# Altium schematic sheet Microcontrolador.V03.R00.SchDoc: Microcontrolador RP2040
size A3; SheetNumber: 2; SheetTotal: 18
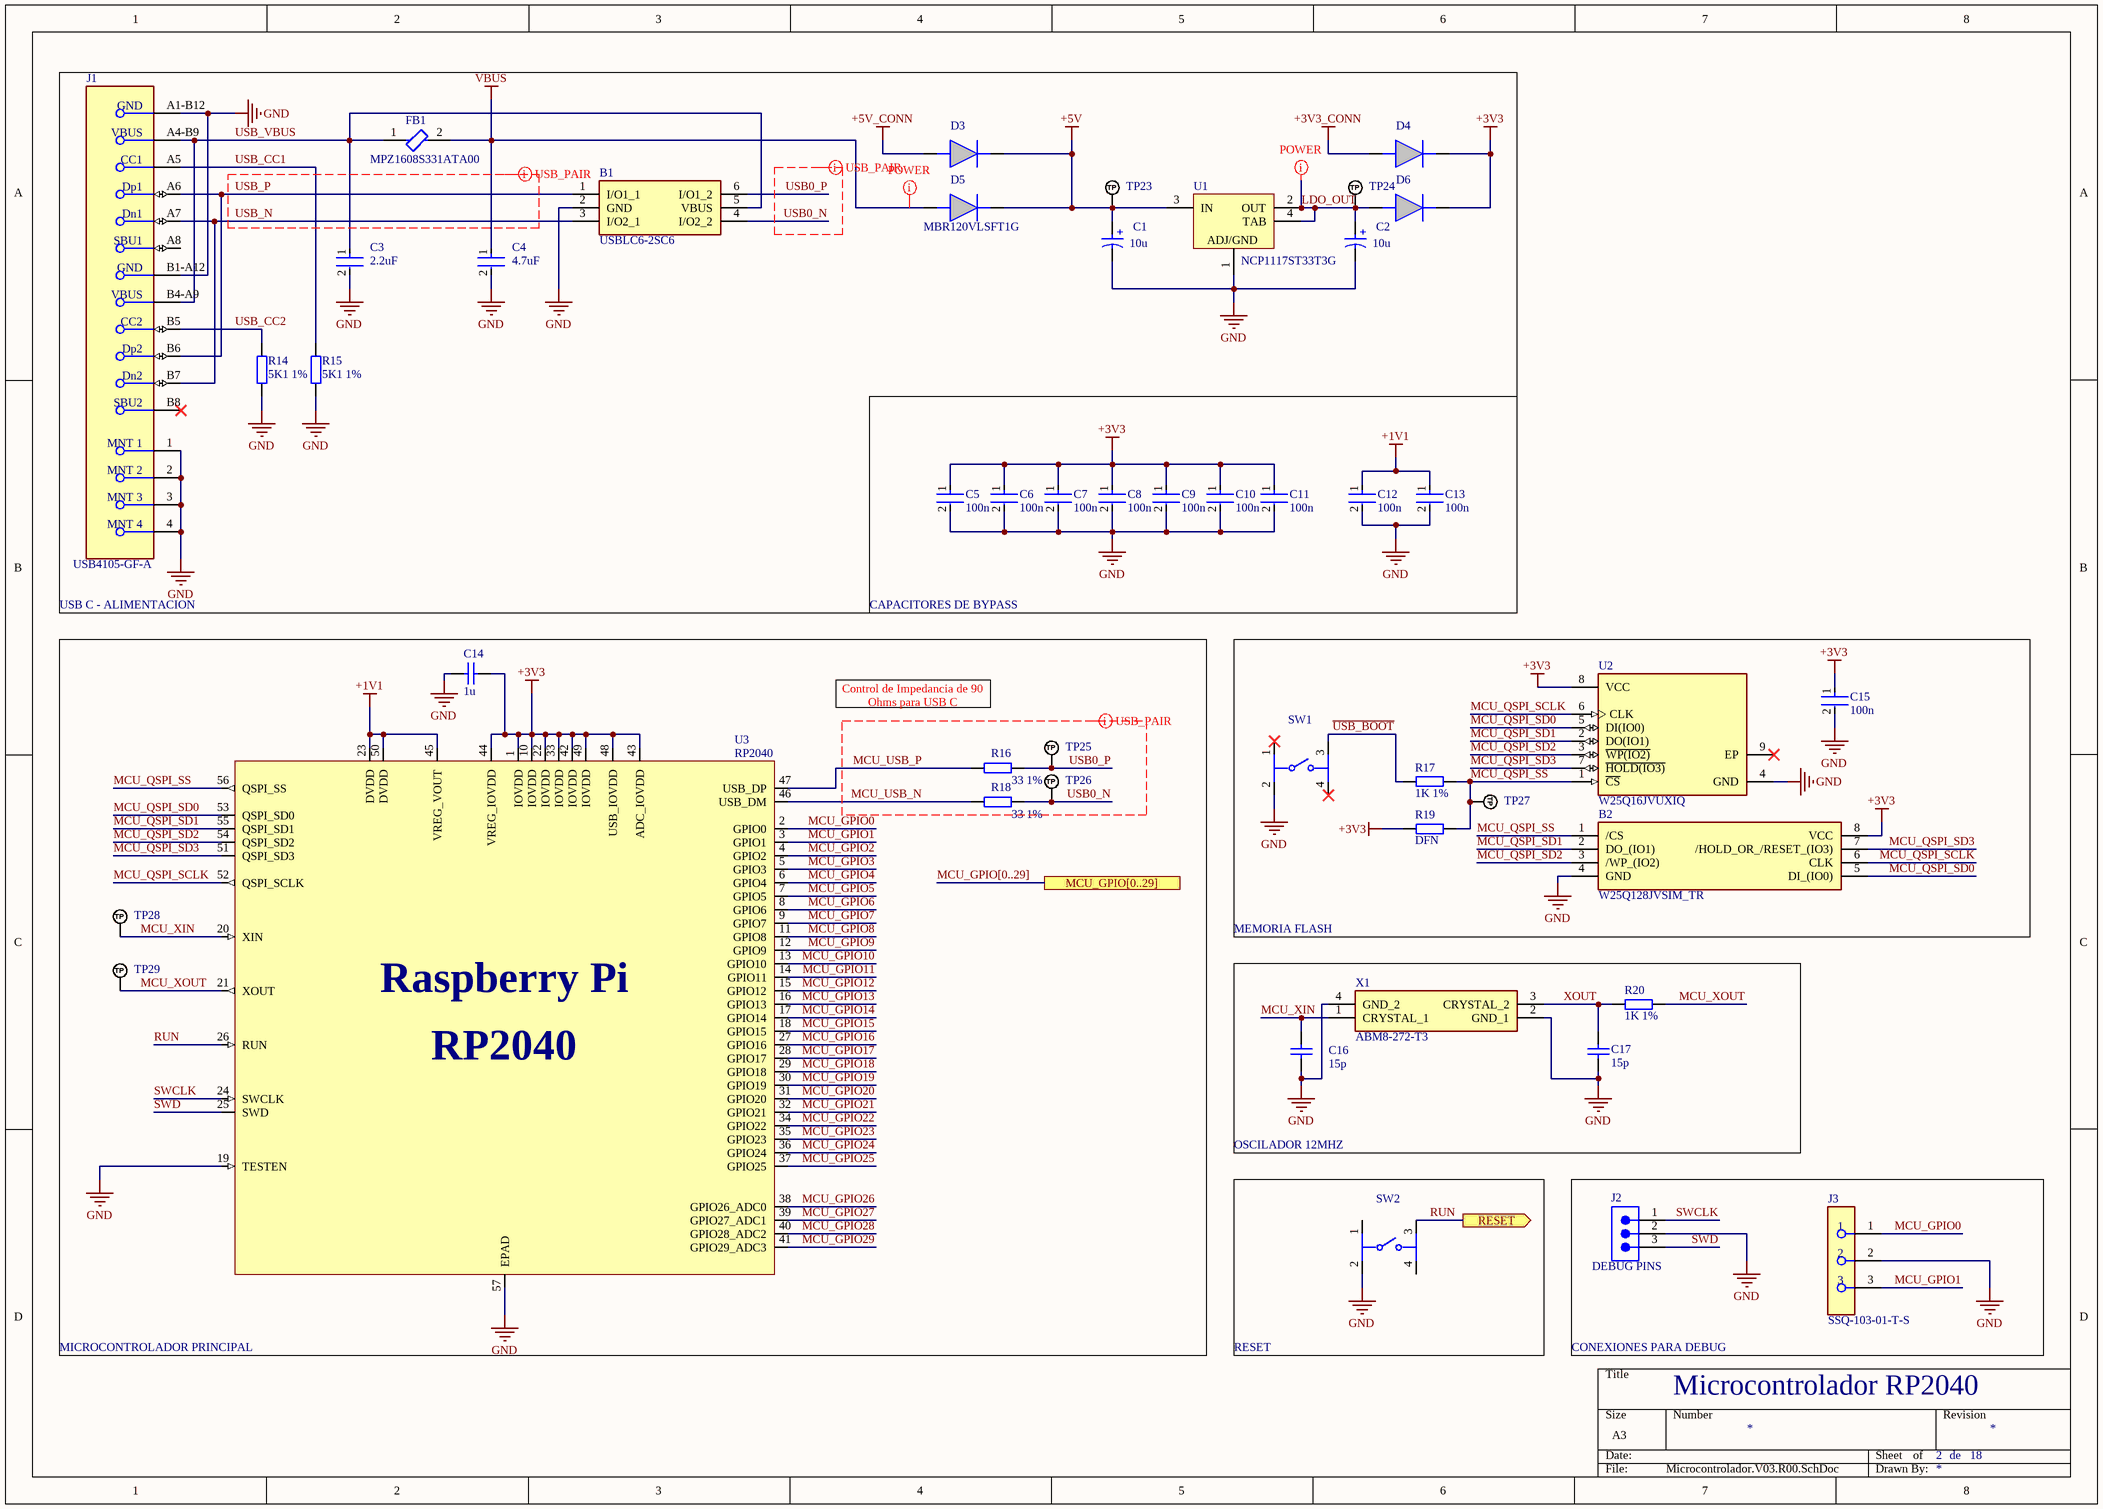
[diagram p0: Microcontrolador.V03.R00.SchDoc]

## Parts
B1  USBLC6-2SC6  [SOT95P280X145-6N]
B2  W25Q128JVSIM_TR  [SOIC127P790X216-8N]
C1  10u  [WCAP-ASLI_D6.3H7.7]
C2  10u  [WCAP-ASLI_D6.3H7.7]
C3  2.2uF  [FP-CC0603-DA-MFG]
C4  4.7uF  [FP-GRM21B-0_15-IPC_A]
C5  100n  [FP-CC0805-EB-MFG]
C6  100n  [FP-CC0805-EB-MFG]
C7  100n  [FP-CC0805-EB-MFG]
C8  100n  [FP-CC0805-EB-MFG]
C9  100n  [FP-CC0805-EB-MFG]
C10  100n  [FP-CC0805-EB-MFG]
C11  100n  [FP-CC0805-EB-MFG]
C12  100n  [FP-CC0805-EB-MFG]
C13  100n  [FP-CC0805-EB-MFG]
C14  1u  [CAPC2013X140X50NL20T25]
C15  100n  [FP-CC0805-EB-MFG]
C16  15p  [CAPC2013X94X50NL20T25]
C17  15p  [CAPC2013X94X50NL20T25]
D3  MBR120VLSFT1G  [SODFL3616X98N]  (value not drawn)
D4  MBR120VLSFT1G  [SODFL3616X98N]  (value not drawn)
D5  MBR120VLSFT1G  [SODFL3616X98N]
D6  MBR120VLSFT1G  [SODFL3616X98N]  (value not drawn)
FB1  MPZ1608S331ATA00  [FP-MPZ1608-0_8-IPC_C]
J1  USB4105-GF-A  [FP-USB4105-GF-A-MFG]
J2  DEBUG PINS  [SMTC-MTSW-103-08-X-S-229-RA]
J3  SSQ-103-01-T-S  [FP-SSQ-103-01-T-S-MFG]
R14  5K1 1%  [RES_0805]
R15  5K1 1%  [RES_0805]
R16  33 1%  [RES_0805]
R17  1K 1%  [RES_0805]
R18  33 1%  [RES_0805]
R19  DFN  [RES_0805]
R20  1K 1%  [RES_0805]
SW1  BOOT  [FP-2-1977223-2-MFG]  (value not drawn)
SW2  RESET  [FP-2-1977223-2-MFG]  (value not drawn)
TP23  TP_NOBOM  [PAD_RND_1MM]  (value not drawn)  (no BOM)
TP24  TP_NOBOM  [PAD_RND_1MM]  (value not drawn)  (no BOM)
TP25  TP_NOBOM  [PAD_RND_1MM]  (value not drawn)  (no BOM)
TP26  TP_NOBOM  [PAD_RND_1MM]  (value not drawn)  (no BOM)
TP27  TP_NOBOM  [PAD_RND_1MM]  (value not drawn)  (no BOM)
TP28  TP_NOBOM  [PAD_RND_1MM]  (value not drawn)  (no BOM)
TP29  TP_NOBOM  [PAD_RND_1MM]  (value not drawn)  (no BOM)
U1  NCP1117ST33T3G  [ONSC-SOT-223-4-318H-01_A_V]
U2  W25Q16JVUXIQ  [FP-UX-MFG]
U3  RP2040  [QFN-56-EP]
X1  ABM8-272-T3  [ABM8272T3]

## Blocks framed on the sheet
USB C - ALIMENTACION: B1 C1-C4 D3-D6 FB1 J1 R14 R15 TP23 TP24 U1
CAPACITORES DE BYPASS: C5-C13
MICROCONTROLADOR PRINCIPAL: C14 R16 R18 TP25 TP26 TP28 TP29 U3
MEMORIA FLASH: B2 C15 R17 R19 SW1 TP27 U2
OSCILADOR 12MHZ: C16 C17 R20 X1
RESET: SW2
CONEXIONES PARA DEBUG: J2 J3

## Ports
MCU_GPIO[0..29], RESET (out)

## Nets
+1V1: C12.1 C13.1 U3.23(DVDD) U3.45(VREG_VOUT) U3.50(DVDD)
+3V3: B2.8(VCC) C5.1 C6.1 C7.1 C8.1 C9.1 C10.1 C11.1 C14.2 C15.1 D4.1(K) D6.1(K) R19.1 U2.8(VCC) U3.1(IOVDD) U3.10(IOVDD) U3.22(IOVDD) U3.33(IOVDD) U3.42(IOVDD) U3.43(ADC_IOVDD) U3.44(VREG_IOVDD) U3.48(USB_IOVDD) U3.49(IOVDD)
+3V3_CONN: D4.2(A)
+5V: C1.1(P) D3.1(K) D5.1(K) TP23.1(TP) U1.3(IN)
+5V_CONN: D3.2(A)
GND: B1.2(GND) B2.4(GND) C1.2(N) C2.2(N) C3.2 C4.2 C5.2 C6.2 C7.2 C8.2 C9.2 C10.2 C11.2 C12.2 C13.2 C14.1 C15.2 C16.1 C17.1 J1.1(MNT_1) J1.2(MNT_2) J1.3(MNT_3) J1.4(MNT_4) J1.A1-B12(GND) J1.B1-A12(GND) J2.2 J3.2 R14.1 R15.1 SW1.2 SW2.2 U1.1(ADJ/GND) U2.4(GND) U3.19(TESTEN) U3.57(EPAD) X1.2(GND_1) X1.4(GND_2)
VBUS: C4.1 D5.2(A) FB1.2
~{USB_BOOT}: R17.1 SW1.3
LDO_OUT: C2.1(P) D6.2(A) TP24.1(TP) U1.2(OUT) U1.4(TAB)
MCU_GPIO0: J3.1 U3.2(GPIO0)
MCU_GPIO1: J3.3 U3.3(GPIO1)
MCU_GPIO2: U3.4(GPIO2)
MCU_GPIO3: U3.5(GPIO3)
MCU_GPIO4: U3.6(GPIO4)
MCU_GPIO5: U3.7(GPIO5)
MCU_GPIO6: U3.8(GPIO6)
MCU_GPIO7: U3.9(GPIO7)
MCU_GPIO8: U3.11(GPIO8)
MCU_GPIO9: U3.12(GPIO9)
MCU_GPIO10: U3.13(GPIO10)
MCU_GPIO11: U3.14(GPIO11)
MCU_GPIO12: U3.15(GPIO12)
MCU_GPIO13: U3.16(GPIO13)
MCU_GPIO14: U3.17(GPIO14)
MCU_GPIO15: U3.18(GPIO15)
MCU_GPIO16: U3.27(GPIO16)
MCU_GPIO17: U3.28(GPIO17)
MCU_GPIO18: U3.29(GPIO18)
MCU_GPIO19: U3.30(GPIO19)
MCU_GPIO20: U3.31(GPIO20)
MCU_GPIO21: U3.32(GPIO21)
MCU_GPIO22: U3.34(GPIO22)
MCU_GPIO23: U3.35(GPIO23)
MCU_GPIO24: U3.36(GPIO24)
MCU_GPIO25: U3.37(GPIO25)
MCU_GPIO26: U3.38(GPIO26_ADC0)
MCU_GPIO27: U3.39(GPIO27_ADC1)
MCU_GPIO28: U3.40(GPIO28_ADC2)
MCU_GPIO29: U3.41(GPIO29_ADC3)
MCU_QSPI_SCLK: B2.6(CLK) U2.6(CLK) U3.52(QSPI_SCLK)
MCU_QSPI_SD0: B2.5(DI_(IO0)) U2.5(DI(IO0)) U3.53(QSPI_SD0)
MCU_QSPI_SD1: B2.2(DO_(IO1)) U2.2(DO(IO1)) U3.55(QSPI_SD1)
MCU_QSPI_SD2: B2.3(/WP_(IO2)) U2.3(~{WP(IO2)}) U3.54(QSPI_SD2)
MCU_QSPI_SD3: B2.7(/HOLD_OR_/RESET_(IO3)) U2.7(~{HOLD(IO3)}) U3.51(QSPI_SD3)
MCU_QSPI_SS: B2.1(/CS) R17.2 R19.2 TP27.1(TP) U2.1(~{CS}) U3.56(QSPI_SS)
MCU_USB_N: R18.1 U3.46(USB_DM)
MCU_USB_P: R16.1 U3.47(USB_DP)
MCU_XIN: C16.2 TP28.1(TP) U3.20(XIN) X1.1(CRYSTAL_1)
MCU_XOUT: R20.2 TP29.1(TP) U3.21(XOUT)
RUN: SW2.3 U3.26(RUN) ; port RESET
SWCLK: J2.1 U3.24(SWCLK)
SWD: J2.3 U3.25(SWD)
USB0_N: B1.4(I/O2_2) R18.2 TP26.1(TP)
USB0_P: B1.6(I/O1_2) R16.2 TP25.1(TP)
USB_CC1: J1.A5(CC1) R15.2
USB_CC2: J1.B5(CC2) R14.2
USB_N: B1.3(I/O2_1) J1.A7(Dn1) J1.B7(Dn2)
USB_P: B1.1(I/O1_1) J1.A6(Dp1) J1.B6(Dp2)
USB_VBUS: B1.5(VBUS) C3.1 FB1.1 J1.A4-B9(VBUS) J1.B4-A9(VBUS)
XOUT: C17.2 R20.1 X1.3(CRYSTAL_2)

Not connected (* = marked no-connect by the designer): J1 A8(SBU1) B8(SBU2)*; SW1 1* 4*; SW2 1 4; U2 9(EP)*

## Buses and harness runs
bus MCU_GPIO[0..29] = port MCU_GPIO[0..29]

## Layout directives
differential pair; differential pair class USB; rule Differential Pairs Routing [Pref Gap = 0.127mm    Min Gap  = 0.127mm    Max Gap  = 0.2mmPref Width = 0.15mm    Min Width  = 0.116mm    Max Width  = 0.16mm]; rule Matched Net Lengths [Tolerance = 0.25mm]; net class USB: MCU_USB_N, MCU_USB_P, USB0_N, USB0_P, USB_N, USB_P
net class POWER; rule Width Constraint [Pref Width = 0.5mm    Min Width = 0.2mm    Max Width = 1mm]; rule Routing Via Style [Pref Size = 1.27mm    Pref Hole Size = 0.711mm]; rule Clearance Constraint [Clearance = 0.2mm]; rule Polygon Connect Style [Style - Direct Connect]: LDO_OUT, VBUS

## Notes on the sheet
- Control de Impedancia de 90 Ohms para USB C
- de
- (in symbol CMP-03913-89507488-2) +

## Library data of the parts
B1 = USBLC6-2SC6: TVS Diode Array Uni-Directional USBLC6-2SC6 17V, SOT-23 6-Pin; Manufacturer_Name: STMicroelectronics; Geometry.Height: 1.45mm; Mouser Part Number: 511-USBLC6-2SC6; Mouser Price/Stock: https://www.mouser.co.uk/ProductDetail/STMicroelectronics/USBLC6-2SC6?qs=po45yt2pPpu%2FhNIlwQdTlg%3D%3D; Manufacturer_Part_Number: USBLC6-2SC6; Datasheet Link: https://www.st.com/resource/en/datasheet/usblc6-2.pdf
B2 = W25Q128JVSIM_TR: 3V 128M-BIT SERIAL FLASH MEMORY WITH DUAL/QUAD SPI & QPI & DTR; Manufacturer_Name: Winbond; Manufacturer_Part_Number: W25Q128JVSIM TR; Geometry.Height: 2.16mm; Mouser Part Number: 454-W25Q128JVSIMTR; Mouser Price/Stock: https://www.mouser.co.uk/ProductDetail/Winbond/W25Q128JVSIM-TR?qs=qSfuJ%252Bfl%2Fd6ji9IuruL6Zg%3D%3D; Datasheet Link: http://www.winbond.com/resource-files/w25q128jv%20dtr%20revb%2011042016.pdf
C1 C2 = CMP-03913-89507488-2: WCAP-ASLI Radial Can - SMD aluminum electrolytic capacitor 0.248Dia 6.30mm ±20% 10muF 80V; Capacitance: 10µF; Leakage Current: 8µA; Insulation Resistance: 10MΩ; Ripple Current: 35mA; Impedance: 2.661Ω; Max Operating Temperature: 105°C; RoHS: Compliant; Voltage Rating: 80V; Width: 6.6mm; Min Operating Temperature: -55°C; Voltage Rating (DC): 80V; Packaging: Cut Tape; Diameter: 6.3mm; Height: 7.7mm; Length: 7.7mm
C3 = CMP-03422-000187-1: CC0603 2.2 uF X5R 10.00% 16 V; Manufacturer: YAGEO; Manufacturer Part Number: CC0603KPX5R7BB225; Voltage Rating: 16 V; Material: Ceramic; Tolerance: 0.1; Temperature Coefficient: 15%; ComponentLink2Description: Datasheet; Device Class L3: Ceramic Capacitors; Temperature Characteristic: X5R; Package: CC0603-DA; Automotive: No; Device Class L1: Passive Components; ComponentLink2URL: http://www.yageo.com/documents/recent/UPY-GPHC_X7R_6.3V-to-50V_18.pdf; Value: 2.2 uF; RoHS: TRUE; Height: 0.9mm; Temperature Range High: +125°C; Footprint Url: http://www.yageo.com/exep/pages/download/literatures/UPY-C_GEN_24.pdf; Lead Free: Yes; Temperature Range Low: -55°C; Capacitance: 2.2 uF; Octopart: https://octopart.com/cc0603kpx5r7bb225-yageo-91091799; Device Class L2: Capacitors; Voltage: 16 V; Temperature: -55°C to +125°C; Category: Cap
C4 = CMP-06035-033280-1: Chip Multilayer Ceramic Capacitors for General Purpose, 0805, 4.7uF, X6S, 22%, 20%, 35V; Length: 2mm; Dielectric: X6S; Width: 1.25mm; Capacitance: 4.7uF; Case/Package: 0805; Tolerance: 20%; Voltage Rating (DC): 35V; Thickness: 1.25mm
C5-C13 C15 = CMP-00621-107850848-1: CC0805KKX7RYBB104 Capacitor Ceramic 0.01uF 250V X7R 10% 0805 T/R; Capacitance: 100nF; Material: Ceramic; Max Operating Temperature: 125°C; Tolerance: 10%; Case/Package: 0805; NexarPartId: 107850848; Height: 1.45mm; Min Operating Temperature: -55°C; Voltage Rating: 250V
C14 = CMP-2007-04663-1: Part Number: 0805YD105MAT2A; Manufacturer: AVX Interconnect / Elco
C16 C17 = CMP-1036-01049-2: Part Number: 08051A150FAT2A; Manufacturer: AVX Interconnect / Elco
D3-D6 = MBR120VLSFT1G: Guardring for Stress Protection; Optimized for Very Low Forward Voltage; 125 C Operating Junction Temperature; Epoxy Meets UL94, VO; Package Designed for Optimal Automated Board Assembly; ESD Rated Machine Model C; ESD Rated Human Body Model 3B; Device Meets MSL 1 Requirements; Pb-Free Packages are Available; Manufacturer_Name: onsemi; Geometry.Height: 0.98mm; Mouser Part Number: 863-MBR120VLSFT1G; Mouser Price/Stock: https://www.mouser.co.uk/ProductDetail/onsemi/MBR120VLSFT1G?qs=3JMERSakebpX%252BkItPpFCkg%3D%3D; Manufacturer_Part_Number: MBR120VLSFT1G; Datasheet Link: https://www.onsemi.com/pub/Collateral/MBR120VLSFT1-D.PDF
FB1 = CMP-08257-000202-1: Power line Ferrite Bead 330Ω @ 100MHz 1.7A DCR 0.08Ω SMD 0603; Impedance: 330R; DC Resistance (DCR): 80mR; Tolerance: 25%; Mount: Surface Mount; Current Rating: 1.7A; Case Code (Metric): 1608; REACH SVHC: No SVHC; Package Quantity: 1; Core Material: Ferrite; Lead Free: Lead Free; Case Code (Imperial): 0603; Max DC Current: 1.7A; Length: 0.063inch; Height: 0.037inch; RoHS Compliant: Yes; Width: 0.031inch; Packaging: Tape and Reel; Case/Package: 0603
J1 = CMP-245163-000001-1: CONN RCPT USB2.0 TYPEC 5A; Manufacturer: GCT; Voltage Rating: 20V; Is Female: yes; Current Rating: 5/6.25/1.25/0.25A; Number Of Contacts: 16; Conn Orientation: Right Angle; Device Class L1: Connectors; Category: Conn; Lead Free: Yes; RoHS: TRUE; Temperature Range High: +85°C; Digikey Description: CONN RCPT USB2.0 TYPEC 5A; Device Class L3: unset; ComponentLink2Description: Datasheet; Manufacturer Part Number: USB4105-GF-A; Package: 0; Usb Standard: USB 2.0; Device Class L2: USB Connectors; Automotive: No; Temperature Range Low: -40°C; Height: 3.46mm; Temperature: -40°C to +85°C; Contact Material: Gold,Nickel; ComponentLink2URL: https://gct.co/files/drawings/usb4105.pdf; Octopart: https://octopart.com/usb4105-gf-a-gct-106627878
J2 = CMP-1024-00100-1: Modified .025" SQ Post Header, Through-hole, Right Angle, -55 to 125 degC, 2.54 mm Pitch, 3-Pin, Male, RoHS; Manufacturer: Samtec; PartNumber: MTSW-103-08-G-S-229-RA; Pitch: 2.54 mm; ComponentLink1URL: http://www.samtec.com; ComponentLink3Description: Package Specification; Mounting Technology: Through-hole; PackageDescription: Assembly .025" [.64] SQ Post Terminal Strip; ComponentLink2URL: http://www.samtec.com/documents/webfiles/pdf/MTSW.PDF; PackageVersion: BI, 2/1987; ComponentLink1Description: Manufacturer URL; PackageReference: MTSW-103-08-X-S-229-RA; Orientation: Right Angle; DatasheetVersion: F-214; RoHS: True; Temperature Range: -55 to 125 degC; ComponentLink3URL: http://www.samtec.com/documents/webfiles/cpdf/MTSW-XXX-XX-X-X-XXXX-XX-XXX-MKT1.pdf; ComponentLink2Description: Datasheet
J3 = CMP-02766-001396-1: CONN RCPT 3POS 0.1 TIN PCB; Pitch: 2.54mm; Connector Type: Receptacle; Max Current Rating: 7.6A; Max Voltage Rating (AC): 550V; Gender: Female; Number of Positions: 3; Contact Resistance: 10mR; Length: 8.13mm; Color: Black; Packaging: Bulk; Height: 8.51mm; RoHS Compliant: Yes; Min Operating Temperature: -55°C; Contact Type: Female Socket; Number of Rows: 1; Series: SSQ; Housing Color: Black; Lead Free: Lead Free; Mount: Through Hole; Housing Material: Plastic; Contact Material: Bronze; Contact Plating: Tin; Orientation: Straight; Termination: Solder; Max Operating Temperature: 105°C; Width: 2.41mm; Radiation Hardening: No; Number of Contacts: 3
R14-R20 = RES_0805: Resistor SMD 0805; Manufacturer: *; Manufacturer Part Number: *; Distributor Link: *; LCSC: *
SW1 SW2 = CMP-03407-000026-1: SWITCH TACTILE SPST-NO 0.05A 24V; RoHS Compliant: Yes
TP23-TP29 = TEST_POINT_RND_1MM: Test Point Round 1mm (NO BOM)
U1 = CMP-1679-00010-1: Low-Dropout Positive Fixed Voltage Regulator, 1 A, 3.3 V Output Voltage, 0 to 125 degC, 4-Pin SOT-223 (318H-01), Pb-Free, Tape and Reel; Resistance: 220 kohm; Type (Resistor): Thick Film; Voltage Rating: 75 V; Tolerance: 1%; Case\Package: 0603; Power Rating: 100 mW; Width: 0.85 mm; Weight: 7.1E-05 oz; ComponentLink2URL: http://www.onsemi.com/pub_link/Collateral/NCP1117-D.PDF; RoHSCompliant: true; Height: 0.45 mm; PackageDescription: 4-Pin Small Outline Transistor, Body 6.5 x 3.5 mm, Pitch 2.3 mm; ComponentLink1Description: Manufacturer URL; ComponentLink1URL: http://www.onsemi.com/; PackageReference: SOT-223-4-318H-01_A; Max Operating Temperature: 155 degC; Packaging: Tape and Reel; REACH SVHC: Unknown; Length: 1.55 mm; Package Quantity: 5000; Radiation Hardening: No; Min Operating Temperature: -55 degC; DatasheetVersion: Rev. 27, 09/2014; Mount: Surface Mount; Case Code (Imperial): 0603; Case Code (Metric): 1608; ComponentLink2Description: Datasheet
U2 = CMP-78876-000011-1: IC FLASH 16MBIT SPI/QUAD 8USON; RoHS Compliant: Yes
U3 = RP2040: 32-Bit Dual-Core ARM Cortex-M0+ Microcontroller; Manufacturer: Raspberry Pi; Manufacturer Part Number: RP2040
X1 = ABM8-272-T3: Crystal, 12 MHz, SMD, 3.2mm x 2.5mm, 30 ppm, 10 pF, 30 ppm, ABM8 Series; Manufacturer_Name: ABRACON; Geometry.Height: 0.8mm; Mouser Part Number: 815-ABM8-272-T3; Mouser Price/Stock: https://www.mouser.co.uk/ProductDetail/ABRACON/ABM8-272-T3?qs=QpmGXVUTftEj6miOiJBMxQ%3D%3D; Manufacturer_Part_Number: ABM8-272-T3; Datasheet Link: https://abracon.com/datasheets/ABM8-272-T3.pdf